# Altium schematic sheet MCP.SchDoc
size A; SheetNumber: 4; SheetTotal: 5
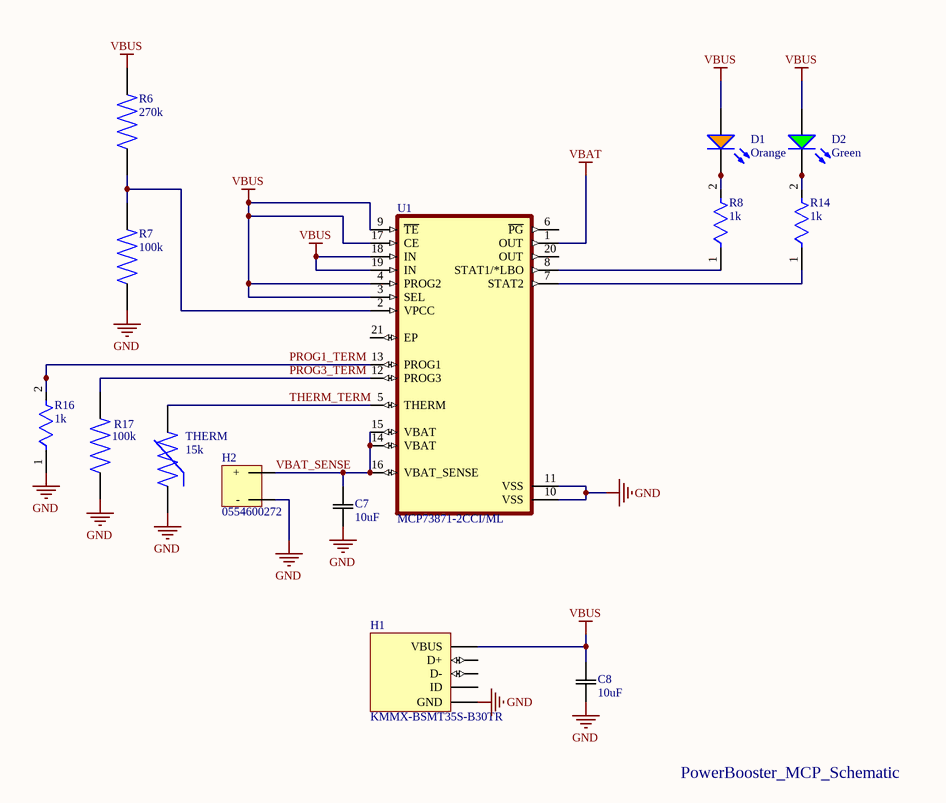
[diagram p0: MCP.SchDoc]

## Parts
C7  10uF  [C10uF]
C8  10uF  [C10uF]
D1  Orange  [LED_orange_0805]
D2  Green  [LED_green_0805]
H1  KMMX-BSMT35S-B30TR  [MICROUSB Connector]
H2  0554600272  [JST_Header]
R6  270k  [R270k]
R7  100k  [R100K]
R8  1k  [Res 0805 1k]
R14  1k  [Res 0805 1k]
R16  1k  [Res 0805 1k]
R17  100k  [R100K]
THERM  15k  [NTC THERM 15K]
U1  MCP73871-2CCI/ML  [MCP]

## Nets
GND: C7.1 C8.1 H1.5(GND) H2.2(-) R7.1 R16.1 R17.1 THERM.1 U1.10(VSS) U1.11(VSS)
VBAT: U1.1(OUT)
VBUS: C8.2 D1.1(A) D2.2(A) H1.1(VBUS) R6.2 U1.3(SEL) U1.4(PROG2) U1.9(~{TE}) U1.17(CE) U1.18(IN) U1.19(IN)
PROG1_TERM: R16.2 U1.13(PROG1)
PROG3_TERM: R17.2 U1.12(PROG3)
THERM_TERM: THERM.2 U1.5(THERM)
VBAT_SENSE: C7.2 H2.1(+) U1.14(VBAT) U1.15(VBAT) U1.16(VBAT_SENSE)
NetD1_2: D1.2(K) R8.2
NetD2_1: D2.1(K) R14.2
NetR6_1: R6.1 R7.2 U1.2(VPCC)
NetR8_1: R8.1 U1.8(STAT1/*LBO)
NetR14_1: R14.1 U1.7(STAT2)

Not connected (* = marked no-connect by the designer): H1 2(D-) 3(D+) 6(ID); U1 6(~{PG}) 20(OUT) 21(EP)

## Notes on the sheet
- PowerBooster_MCP_Schematic

## Library data of the parts
C7 C8 = CL21A106KOQNNNE: Ceramic capacitor SMD-0805 10000nF (10uF) /16V X5R# K +-10% Samsung , RoHS/4000pcs/; Tolerance: 10%; Voltage Rating: 16V; Dielectric: X7R; Supplier 1: Digi-Key; Supplier Part Number 1: 1276-1096-1-ND; Manufacturer: Samsung; Manufacturer Part Number: CL21A106KOQNNNE; RoHS: Yes; Category: Ceramic Capacitors; Stock 1: 250843; Pricing 1: 1=0.11000, 10=0.08100, 50=0.04400, 100=0.03600, 500=0.02568, 1000=0.02018 (USD); Mount: Surface Mount; Case/Package: 0805; Case Code (Metric): 2012; Case Code (Imperial): 0805; Min Operating Temperature: -55°C; Max Operating Temperature: 85°C; Package Quantity: 1; Packaging: Tape and Reel; Capacitance: 10uF; Voltage Rating (DC): 16V; Voltage: 16V; Series: CL; Construction: Flat; Length: 2mm; Width: 0.049inch; Height: 1.25mm; Thickness: 0.055inch; Depth: 1.25mm; Radiation Hardening: No; Lead Free: Lead Free; RoHS Compliant: Yes; ComponentLink1URL: https://datasheet.ciiva.com/25798/cl21a106koqnnne-25798133.pdf?src-supplier=Digi-Key; ComponentLink1Description: https://datasheet.ciiva.com/25798/cl21a106koqnnne-25798133.pdf?src-supplier=Digi-Key; ComponentLink2URL: https://datasheet.ciiva.com/15216/getdatasheetpartid-358435-15216234.pdf?src-supplier=Verical; ComponentLink2Description: https://datasheet.ciiva.com/15216/getdatasheetpartid-358435-15216234.pdf?src-supplier=Verical; ComponentLink3URL: https://datasheet.ciiva.com/16740/cl05b104kq5nnnc-16740697.pdf?src-supplier=Future+Electronics; ComponentLink3Description: https://datasheet.ciiva.com/16740/cl05b104kq5nnnc-16740697.pdf?src-supplier=Future+Electronics
D1 = HSMD-C170: Diode Led HSMD/C170 AGILENT RoHS Orange SO0805; Manufacturer: Broadcom Avago; Lens Color: White; Luminous Intensity: 8mcd; Forward Voltage: 2.2V; Forward Current: 20mA; Lens Style: Rectangular,Diffused,Colorless; Dominant Wavelength: 604nm; Number of LEDs: 1; Viewing Angle: 170°; Lens Transparency: Diffused; Reverse Voltage: 5V; Power Dissipation: 52mW; Supplier 1: Digi-Key; Manufacturer Part Number: HSMD-C170; RoHS: Yes; Category: LEDs; Stock 1: 282; Pricing 1: 1=0.41000, 10=0.27000, 100=0.18020, 500=0.12466, 1000=0.10388, 2000=0.09349 (USD); Mount: Surface Mount; Case/Package: 0805; Number of Pins: 2; Color: Orange; Case Code (Metric): 2012; Case Code (Imperial): 0805; Contact Plating: Gold; Min Operating Temperature: -40°C; Max Operating Temperature: 85°C; Packaging: Tape and Reel; Wavelength: 604nm; Package Quantity: 4000; Illumination Color: Orange; Test Current: 20mA; Series: -; Number of Elements: 1; Power Rating: 52mW; Max Power Dissipation: 52mW; Voltage Rating (DC): 2.2V; Length: 2mm; Width: 1.25mm; Height: 0.8mm; Depth: 1.25mm; Radiation Hardening: No; RoHS Compliant: Yes; Lead Free: Lead Free; REACH SVHC: No SVHC; ComponentLink1URL: https://datasheet.ciiva.com/11774/0900766b804a6539-11774453.pdf?src-supplier=RSComponents; ComponentLink1Description: https://datasheet.ciiva.com/11774/0900766b804a6539-11774453.pdf?src-supplier=RSComponents; ComponentLink2URL: https://datasheet.ciiva.com/22656/1825780-22656576.pdf?src-supplier=Element14; ComponentLink2Description: https://datasheet.ciiva.com/22656/1825780-22656576.pdf?src-supplier=Element14; ComponentLink3URL: https://datasheet.ciiva.com/15117/getdatasheetpartid-148813-15117896.pdf?src-supplier=Verical; ComponentLink3Description: https://datasheet.ciiva.com/15117/getdatasheetpartid-148813-15117896.pdf?src-supplier=Verical; ComponentLink4URL: https://datasheet.ciiva.com/29280/180497-da-01-en-chip-led-hsmd-c170-orange-29280979.pdf?src-supplier=Conrad; ComponentLink4Description: https://datasheet.ciiva.com/29280/180497-da-01-en-chip-led-hsmd-c170-orange-29280979.pdf?src-supplier=Conrad; ComponentLink5URL: https://datasheet.ciiva.com/14172/swseriehsmx-c150toc190-e-14172165.pdf?src-supplier=Distrelec; ComponentLink5Description: https://datasheet.ciiva.com/14172/swseriehsmx-c150toc190-e-14172165.pdf?src-supplier=Distrelec; Supplier Part Number 1: 516-1794-1-ND
D2 = 150080VS75000: Led, Green, 570 Nm, 2 V, 30 Ma, 40 Mcd Rohs Compliant: Yes; Manufacturer: Wurth Electronics; Luminous Intensity: 40mcd; Forward Current: 30mA; Forward Voltage: 2V; Viewing Angle: 140°; Wavelength: 570nm; Lens Style: Clear,Rectangular; Test Current: 20mA; Supplier 1: Digi-Key; Manufacturer Part Number: 150080VS75000; RoHS: Yes; Category: LEDs; Stock 1: 26965; Pricing 1: 1=0.18000, 50=0.17100, 100=0.14700, 500=0.12700 (USD); Mount: Surface Mount; Case/Package: 0805; Color: Green; Case Code (Metric): 2012; Case Code (Imperial): 0805; Min Operating Temperature: -40°C; Max Operating Temperature: 85°C; Packaging: Tape and Reel; Dominant Wavelength: 570nm; Package Quantity: 4000; Length: 2mm; Width: 1.25mm; Height: 0.7mm; REACH SVHC: Unknown; ComponentLink1URL: https://datasheet.ciiva.com/22656/150080vs75000-22656966.pdf?src-supplier=Element14; ComponentLink1Description: https://datasheet.ciiva.com/22656/150080vs75000-22656966.pdf?src-supplier=Element14; ComponentLink2URL: https://datasheet.ciiva.com/29279/759437-da-01-en-chipled-0805-w-kl-h-gruen-150080vs7500-29279047.pdf?src-supplier=Conrad; ComponentLink2Description: https://datasheet.ciiva.com/29279/759437-da-01-en-chipled-0805-w-kl-h-gruen-150080vs7500-29279047.pdf?src-supplier=Conrad; ComponentLink3URL: https://datasheet.ciiva.com/29563/150080vs75000-29563018.pdf?src-supplier=Digi-Key; ComponentLink3Description: https://datasheet.ciiva.com/29563/150080vs75000-29563018.pdf?src-supplier=Digi-Key; Supplier Part Number 1: 732-4986-1-ND
H1 = KMMX-BSMT35S-B30TR: Conn Micro USB Type B PL 5 POS 0.65mm Solder RA SMD 5 Terminal 1 Port T/R; Manufacturer: Kycon; Plating: Tin; Current Rating: 1A; Voltage Rating: 30V; Number of Positions: 5; Number of Ports: 1; Supplier 1: Digi-Key; Supplier Part Number 1: 2092-KMMX-BSMT35S-B30CT-ND; Manufacturer Part Number: KMMX-BSMT35S-B30TR; RoHS: Yes; Category: USB Connectors; Stock 1: 3715; Pricing 1: 1=1.30000, 10=1.09600, 25=1.05120, 50=1.02880, 100=0.98410, 250=0.89460, 500=0.80514, 1000=0.71568 (USD); Case/Package: SMD/SMT; Color: Black; Contact Material: Brass; Contact Plating: Gold; Min Operating Temperature: -30°C; Max Operating Temperature: 85°C; Package Quantity: 1500; Packaging: Tape and Reel; Connector Type: USB; Number of Contacts: 5; Termination: Through Hole; Series: KMMX; RoHS Compliant: Yes; ComponentLink1URL: http://www.mouser.com/catalog/specsheets/KMMX-BSMT35S-BTR.pdf?src-supplier=Mouser; ComponentLink1Description: http://www.mouser.com/catalog/specsheets/KMMX-BSMT35S-BTR.pdf?src-supplier=Mouser
H2 = 0554600272: 2.00mm Pitch Mi ll System Wire-to-Board Header, Surface Mount, Single Row, Vertical, 2 Circuits; Manufacturer: Molex; Number of Positions: 2; Connector Type: Male Pin; Max Voltage Rating (AC): 125V; Pitch: 0.079inch; Supplier 1: Digi-Key; Supplier Part Number 1: WM8301CT-ND; Manufacturer Part Number: 0554600272; RoHS: Yes; Category: Headers and Wire Housings; Stock 1: 5282; Pricing 1: 1=1.33000, 10=1.10500, 100=0.92040 (USD); Mount: Surface Mount; Housing Material: Polyamide; Contact Plating: Tin,Copper; Contact Material: Bronze; Color: Natural; Housing Color: Natural; Min Operating Temperature: -40°C; Max Operating Temperature: 105°C; Number of Rows: 1; Packaging: Tape and Reel; Termination: Solder; Orientation: Straight; Length: 8.1mm; Depth: 7mm; RoHS Compliant: Yes; ComponentLink1URL: https://datasheet.ciiva.com/18487/554600272-sd-18487017.pdf?src-supplier=Digi-Key; ComponentLink1Description: https://datasheet.ciiva.com/18487/554600272-sd-18487017.pdf?src-supplier=Digi-Key; ComponentLink2URL: https://datasheet.ciiva.com/18487/554600272-sd-18487018.pdf?src-supplier=Digi-Key; ComponentLink2Description: https://datasheet.ciiva.com/18487/554600272-sd-18487018.pdf?src-supplier=Digi-Key; ComponentLink3URL: https://datasheet.ciiva.com/18487/554600272-sd-18487019.pdf?src-supplier=Digi-Key; ComponentLink3Description: https://datasheet.ciiva.com/18487/554600272-sd-18487019.pdf?src-supplier=Digi-Key
R6 = RMCF0805FT270K: Res Thick Film 0805 270K Ohm 1% 1/8W ±100ppm/°C Molded SMD SMD Paper T/R; Manufacturer: Stackpole Electronics; Resistance: 270kR; Max Power Dissipation: 125mW; Supplier 1: Digi-Key; Supplier Part Number 1: RMCF0805FT270KCT-ND; Manufacturer Part Number: RMCF0805FT270K; RoHS: Yes; Category: Chip SMD Resistors; Stock 1: 32162; Pricing 1: 1=0.10000, 10=0.02700, 100=0.01090, 1000=0.00488, 2500=0.00423 (USD); Mount: Surface Mount; Case/Package: 0805; Contact Plating: Tin,Matte; Min Operating Temperature: -55°C; Max Operating Temperature: 155°C; Packaging: Tape and Reel; Tolerance: 1%; Resistor Type: Thick Film; Number of Terminations: 2; Temperature Coefficient: 100ppm/°C; Features: Automotive AEC-Q200; Series: RMCF; Length: 0.079inch; Width: 0.049inch; Height: 0.026inch; Radiation Hardening: No; Lead Free: Lead Free; RoHS Compliant: Yes; ComponentLink1URL: https://www.seielect.com/Catalog/SEI-RMCF_RMCP.pdf?src-supplier=Digi-Key; ComponentLink1Description: https://www.seielect.com/Catalog/SEI-RMCF_RMCP.pdf?src-supplier=Digi-Key; ComponentLink2URL: https://www.seielect.com/catalog/SEI-RMCF_RMCP.pdf?src-supplier=Avnet; ComponentLink2Description: https://www.seielect.com/catalog/SEI-RMCF_RMCP.pdf?src-supplier=Avnet
R7 R17 = RE1206FRE07100KL: Chip Resistor Precision Grade Thick Film 1206 100kOhm 1% Paper T/R; Manufacturer: Yageo; Resistance: 100kR; Max Power Dissipation: 250mW; Temperature Coefficient: 50ppm/°C; Supplier 1: Digi-Key; Supplier Part Number 1: 13-RE1206FRE07100KLCT-ND; Manufacturer Part Number: RE1206FRE07100KL; RoHS: Yes; Category: Chip SMD Resistors; Stock 1: 11020; Pricing 1: 1=0.10000, 10=0.06800, 100=0.02750, 1000=0.01234, 2500=0.01071 (USD); Case/Package: 1206; Min Operating Temperature: -55°C; Max Operating Temperature: 155°C; Packaging: Tape and Reel; Resistor Type: Thick Film; Number of Terminations: 2; Tolerance: 1%; Features: Moisture Resistant; Length: 0.122inch; Width: 0.063inch; Height: 0.026inch; RoHS Compliant: Yes; ComponentLink1URL: http://www.yageo.com/NewPortal/yageodocoutput?fileName=/pdf/R-Chip/PYu-RE_105_RoHS_L_4.pdf&src-supplier=Digi-Key; ComponentLink1Description: http://www.yageo.com/NewPortal/yageodocoutput?fileName=/pdf/R-Chip/PYu-RE_105_RoHS_L_4.pdf&src-supplier=Digi-Key
R8 R14 R16 = CRGCQ0805F1K0: Res Thick Film 0805 1K Ohm 1% 0.125W(1/8W) ±100ppm/C Pad SMD Automotive T/R; Manufacturer: TE Connectivity; Resistance: 1kR; Max Power Dissipation: 125mW; Temperature Coefficient: 100ppm/°C; Supplier 1: Digi-Key; Manufacturer Part Number: CRGCQ0805F1K0; RoHS: Yes; Category: Chip SMD Resistors; Stock 1: 111660; Pricing 1: 1=0.10000, 10=0.05800, 100=0.02350, 1000=0.01057, 2500=0.00918 (USD); Case/Package: 0805; Case Code (Imperial): 0805; Case Code (Metric): 2012; Min Operating Temperature: -55°C; Max Operating Temperature: 155°C; Resistor Type: Thick Film; Packaging: Cut Tape; Tolerance: 1%; Number of Terminations: 2; Features: Moisture Resistant,Automotive AEC-Q200; RoHS Compliant: Yes; ComponentLink1URL: https://4donline.ihs.com/images/VipMasterIC/IC/TYEL/TYEL-S-A0004929575/TYEL-S-A0004929575-1.pdf?hkey=52A5661711E402568146F3353EA87419&src-supplier=Farnell; ComponentLink1Description: https://4donline.ihs.com/images/VipMasterIC/IC/TYEL/TYEL-S-A0004929575/TYEL-S-A0004929575-1.pdf?hkey=52A5661711E402568146F3353EA87419&src-supplier=Farnell; ComponentLink2URL: https://www.te.com/commerce/DocumentDelivery/DDEController?Action=srchrtrv&DocNm=1773204-3&DocType=DS&DocLang=English&src-supplier=Digi-Key; ComponentLink2Description: https://www.te.com/commerce/DocumentDelivery/DDEController?Action=srchrtrv&DocNm=1773204-3&DocType=DS&DocLang=English&src-supplier=Digi-Key; ComponentLink3URL: https://www.te.com/commerce/DocumentDelivery/DDEController?Action=srchrtrv&amp;DocNm=1773204-3&amp;DocType=DS&amp;DocLang=English&src-supplier=Digi-Key; ComponentLink3Description: https://www.te.com/commerce/DocumentDelivery/DDEController?Action=srchrtrv&amp;DocNm=1773204-3&amp;DocType=DS&amp;DocLang=English&src-supplier=Digi-Key; Supplier Part Number 1: A129749CT-ND
THERM = NCP18XW153J03RB: Thermistor NTC 15K Ohm 5% 2-Pin 0603 Surface Mount Solder Pad 3987K Paper T/R; Manufacturer: Murata; Resistance: 15kR; Power Rating: 100mW; Current Rating: 250uA; Accuracy: 3%; Supplier 1: Digi-Key; Supplier Part Number 1: 490-2444-1-ND; Manufacturer Part Number: NCP18XW153J03RB; RoHS: Yes; Category: Thermistors; Stock 1: 19442; Pricing 1: 1=0.25000, 5=0.22800, 10=0.20300, 25=0.18160, 50=0.15960, 100=0.13610, 500=0.11258, 1000=0.09425 (USD); Mount: Surface Mount; Case/Package: 0603; Number of Pins: 2; Case Code (Metric): 1608; Case Code (Imperial): 0603; Min Operating Temperature: -40°C; Max Operating Temperature: 125°C; Tolerance: 5%; Packaging: Tape and Reel; Package Quantity: 4000; Max Power Dissipation: 100mW; Termination: SMD/SMT; Series: NCP18; Resistance Tolerance: 5%; Length: 1.6mm; Width: 800um; Height: 0.8mm; Depth: 0.8mm; Thickness: 150um; Radiation Hardening: No; Lead Free: Lead Free; RoHS Compliant: Yes; ComponentLink1URL: https://datasheet.ciiva.com/11822/0900766b80a00379-11822042.pdf?src-supplier=RSComponents; ComponentLink1Description: https://datasheet.ciiva.com/11822/0900766b80a00379-11822042.pdf?src-supplier=RSComponents; ComponentLink2URL: https://datasheet.ciiva.com/2848/r44e-2848415.pdf?src-supplier=Digi-Key; ComponentLink2Description: https://datasheet.ciiva.com/2848/r44e-2848415.pdf?src-supplier=Digi-Key; ComponentLink3URL: https://datasheet.ciiva.com/2848/r44e-2848416.pdf?src-supplier=Digi-Key; ComponentLink3Description: https://datasheet.ciiva.com/2848/r44e-2848416.pdf?src-supplier=Digi-Key; ComponentLink4URL: https://datasheet.ciiva.com/2848/r44e-2848417.pdf?src-supplier=Digi-Key; ComponentLink4Description: https://datasheet.ciiva.com/2848/r44e-2848417.pdf?src-supplier=Digi-Key; ComponentLink5URL: https://datasheet.ciiva.com/18225/getdatasheetpartid-325542-18225670.pdf?src-supplier=Verical; ComponentLink5Description: https://datasheet.ciiva.com/18225/getdatasheetpartid-325542-18225670.pdf?src-supplier=Verical
U1 = MCP73871-2CCI/ML: MCP73871 Series Li-Ion/Li-Pol 50 mA - 1000 mA 4.2 V Battery Charger - QFN-20; Manufacturer: Microchip; Output Current: 1A; Output Voltage: 4.2V; Number of Cells: 1; Max Input Voltage: 6V; Min Supply Voltage: 4.5V; Supplier 1: Digi-Key; Supplier Part Number 1: MCP73871-2CCI/ML-ND; Manufacturer Part Number: MCP73871-2CCI/ML; RoHS: Yes; Category: Battery Management; Pricing 1: 1=2.19000, 25=1.82320, 100=1.68000 (USD); Mount: Surface Mount; Case/Package: QFN; Number of Pins: 20; Contact Plating: Tin,Matte; Min Operating Temperature: -40°C; Max Operating Temperature: 85°C; Package Quantity: 91; Max Supply Voltage: 6V; Packaging: Rail/Tube; Max Output Current: 1A; Max Charge Current: 1A; Length: 4mm; Width: 4mm; Height: 0.95mm; Radiation Hardening: No; REACH SVHC: No SVHC; Lead Free: Lead Free; RoHS Compliant: Yes; ComponentLink1URL: https://datasheet.ciiva.com/16296/filehandler-aspxddocname-en536709-16296680.pdf?src-supplier=Future+Electronics; ComponentLink1Description: https://datasheet.ciiva.com/16296/filehandler-aspxddocname-en536709-16296680.pdf?src-supplier=Future+Electronics; ComponentLink2URL: https://datasheet.ciiva.com/3213/22090b-3213433.pdf?src-supplier=Avnet; ComponentLink2Description: https://datasheet.ciiva.com/3213/22090b-3213433.pdf?src-supplier=Avnet; ComponentLink3URL: https://datasheet.ciiva.com/1933/22090b-1933110.pdf?src-supplier=Digi-Key; ComponentLink3Description: https://datasheet.ciiva.com/1933/22090b-1933110.pdf?src-supplier=Digi-Key; ComponentLink4URL: https://datasheet.ciiva.com/1137/1669447-1137947.pdf?src-supplier=Element14; ComponentLink4Description: https://datasheet.ciiva.com/1137/1669447-1137947.pdf?src-supplier=Element14; ComponentLink5URL: https://datasheet.ciiva.com/15114/getdatasheetpartid-448150-15114746.pdf?src-supplier=Verical; ComponentLink5Description: https://datasheet.ciiva.com/15114/getdatasheetpartid-448150-15114746.pdf?src-supplier=Verical